# Altium schematic sheet RS485.SchDoc
size A4
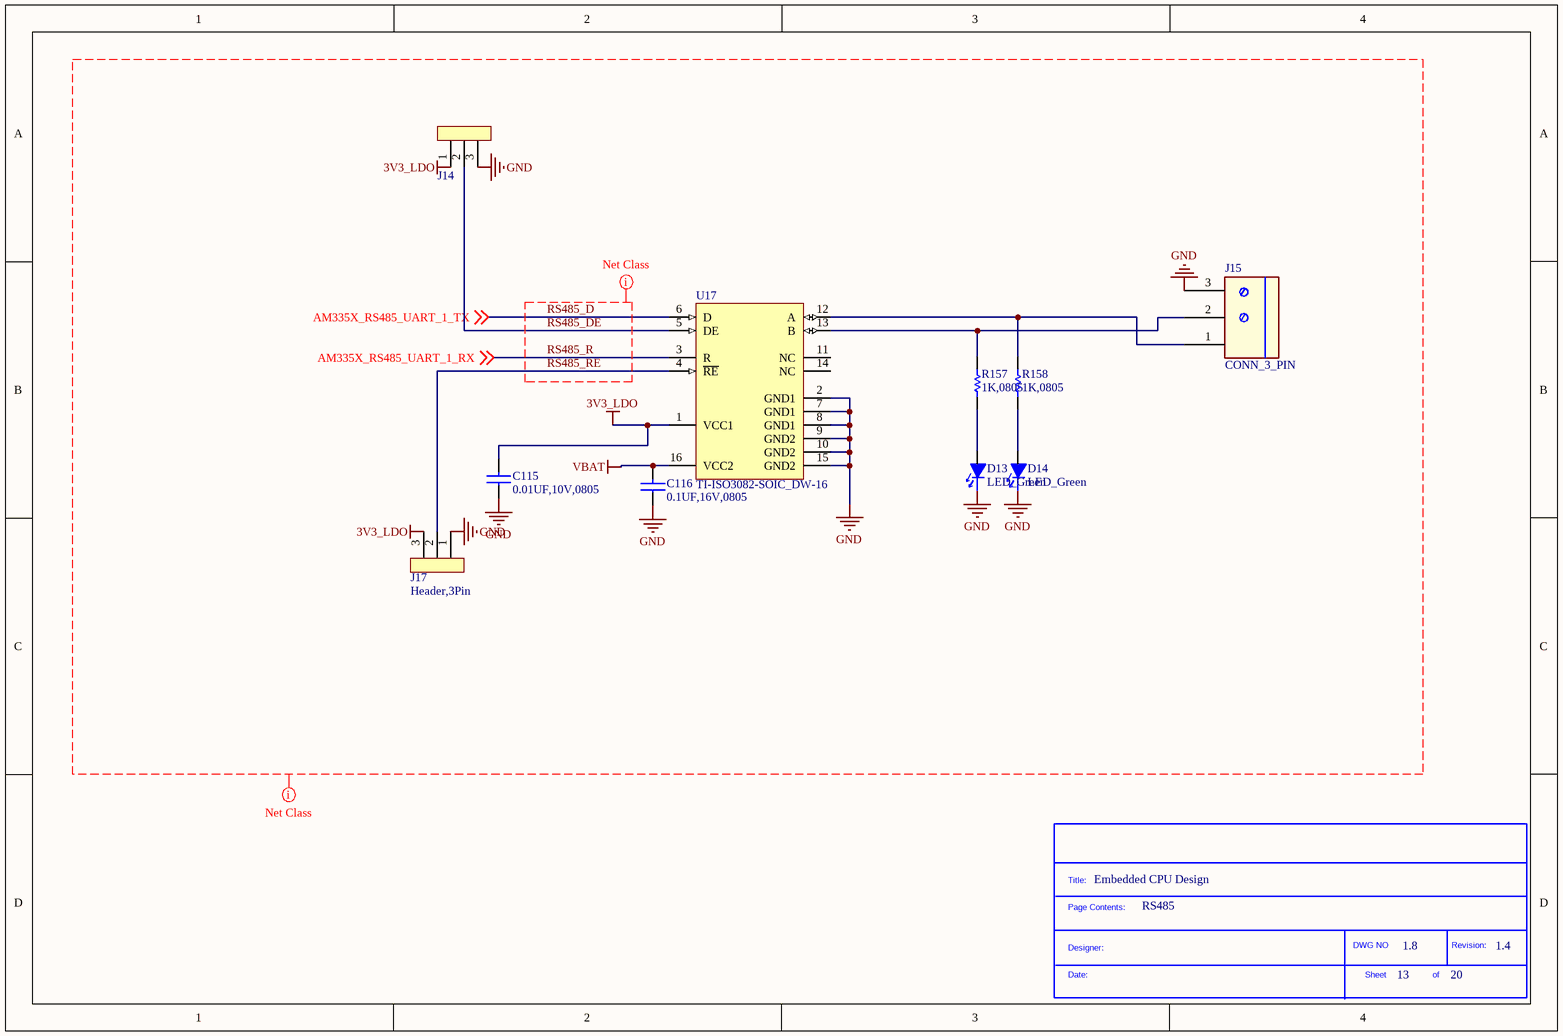
[diagram p0: RS485.SchDoc]

## Parts
*?  SDTitleBlock  (value not drawn)  (graphical)
C115  0.01UF,10V,0805  [0805]
C116  0.1UF,16V,0805  [0805]
D13  LED_Green  [LED_0805]
D14  LED_Green  [LED_0805]
J14  Header,3Pin  [SMD_JUMPER]  (value not drawn)
J15  CONN_3_PIN  [CON_3]
J17  Header,3Pin  [SMD_JUMPER]
R157  1K,0805  [0805]
R158  1K,0805  [0805]
U17  TI-ISO3082-SOIC_DW-16  [DW16_L]

## Nets
3V3_LDO: C115.2 J14.1 J17.3 U17.1(VCC1)
GND: C115.1 C116.1 D13.1(Cathode) D14.1(Cathode) J14.3 J15.3 J17.1 U17.2(GND1) U17.7(GND1) U17.8(GND1) U17.9(GND2) U17.10(GND2) U17.15(GND2)
VBAT: C116.2 U17.16(VCC2)
RS485_D: U17.6(D) ; off-sheet AM335X_RS485_UART_1_TX  [also labelled AM335X_RS485_UART_1_TX]
RS485_DE: J14.2 U17.5(DE)
RS485_R: U17.3(R) ; off-sheet AM335X_RS485_UART_1_RX  [also labelled AM335X_RS485_UART_1_RX]
RS485_RE: J17.2 U17.4(~{RE})
NetD13_2: D13.2(Anode) R157.2
NetD14_2: D14.2(Anode) R158.2
NetJ15_1: J15.1 R158.1 U17.12(A)
NetJ15_2: J15.2 R157.1 U17.13(B)

Not connected (* = marked no-connect by the designer): U17 11(NC) 14(NC)

## Layout directives
net class RS485: RS485_D, RS485_DE, RS485_R, RS485_RE
net class RS485_P: 3V3_LDO, AM335X_RS485_UART_1_RX, AM335X_RS485_UART_1_TX, GND, RS485_D, RS485_DE, RS485_R, RS485_RE, VBAT

## Notes on the sheet
- Embedded CPU Design
- RS485
- 13
- 1.8
- 20
- 1.4
- (in symbol SDTitleBlock) Title:; Page Contents:; DWG NO; Revision:; Designer:; Date:; Sheet; of

## Library data of the parts
C115 = 0.01UF,10V,0805: MULTICOMP - MCSH21B103K100CT - CAP, MLCC, X7R, 10NF, 10V, 0805; Capacitance: 10000pF; Tolerance: ±10%; Voltage - Rated: 16V; Supplier 1: Digi-Key; Manufacturer: MULTICOMP; Manufacturer Part Number: MCSH21B103K100CT; RoHS: YES; Stock 1: 21284; Pricing 1: 1=0.24, 10=0.2, 50=0.1126, 100=0.1, 250=0.075, 500=0.06626, 1000=0.05875 (USD); ComponentLink1URL: http://www.farnell.com/datasheets/1825494.pdf; ComponentLink1Description: http://www.farnell.com/datasheets/1825494.pdf; Supplier Part Number 1: 399-7995-1-ND; Category: Capacitors; Packaging: Cut Tape (CT); Temperature Coefficient: X7R; Mounting Type: Surface Mount, MLCC; Operating Temperature: -55°C ~ 125°C; Applications: General Purpose; Ratings: -; Package / Case: 0805 (2012 Metric); Size / Dimension: 0.079" L x 0.049" W (2.00mm x 1.25mm); Height - Seated (Max): -; Thickness (Max): 0.035" (0.88mm); Lead Spacing: -; Features: -; Lead Style: -; ComponentLink2URL: http://www.kemet.com/docfinder?Partnumber=C0805C103K4RACTU; ComponentLink2Description: http://www.kemet.com/docfinder?Partnumber=C0805C103K4RACTU
C116 = 0.1UF,16V,0805: AVX - 0805YC104KAT2A - CAP, MLCC, X7R, 100NF, 16V, 0805; Capacitance: 0.1; Capacitance Tolerance: ± 10%; Dielectric Characteristic: X7; Voltage Rating: 16; Ceramic Capacitor Case: 0805 [2012 Metric]; SVHC: No SVHC (16-Jun-2014); Capacitor Case Style: 0805 [2012 Metric]<!--FANDB--><div class="features-and-benefits-container"></div>; Tolerance: ±10%; Supplier 1: Digi-Key; Manufacturer: AVX; Manufacturer Part Number: 0805YC104KAT2A; RoHS: YES; Stock 1: 9101; Pricing 1: 1=0.29, 10=0.198, 100=0.1008, 250=0.0816, 500=0.072, 1000=0.0612 (USD); Product Range: -; Operating Temperature Min: -55; Operating Temperature Max: 125; Packaging: Cut Tape; MSL: MSL 1 - Unlimited; Capacitance Tolerance ±: ± 10%; ComponentLink1URL: http://www.farnell.com/datasheets/1679506.pdf; ComponentLink1Description: http://www.farnell.com/datasheets/1679506.pdf; Supplier Part Number 1: 478-7961-1-ND; Category: Capacitors; Voltage - Rated: 16V; Temperature Coefficient: X7R; Mounting Type: Surface Mount, MLCC; Operating Temperature: -55°C ~ 125°C; Applications: General Purpose; Ratings: -; Package / Case: 0805 (2012 Metric); Size / Dimension: 0.079" L x 0.049" W (2.00mm x 1.25mm); Height - Seated (Max): -; Thickness (Max): 0.037" (0.94mm); Lead Spacing: -; Features: -; Lead Style: -; ComponentLink2URL: http://www.avx.com/docs/Catalogs/cx7r.pdf; ComponentLink2Description: http://www.avx.com/docs/Catalogs/cx7r.pdf
D13 D14 = LED_Green: LED Green SMD 20mA 2V 0805; TIIntPartnumber: 1F0008; MfrNum: 598-8170-107F; Mfr: Dialight; PartName: LEDGreen2x1.5; Cost10K: 0.052; Cost100: 0.081; Vendor: Digikey; Wavelength - Dominant: 566nm; Millicandela Rating: 20mcd; Viewing Angle: 140°; Lens Type: Clear; Lens Style/Size: Rectangle with Flat Top, 1.4mm x 1.25mm; DescriptiveText: LED Green SMD 20mA 2V 0805; Descriptive_Text: LED Green SMD 20mA 2V 0805; Supplier 1: Digi-Key; Manufacturer: Dialight; Manufacturer Part Number: 598-8170-107F; RoHS: RoHS Compliant; Category: Optoelectronics; Stock 1: 91030; Pricing 1: 1=0.42, 10=0.31, 25=0.248, 100=0.1643, 250=0.1364, 500=0.0992, 1000=0.0775 (USD); Packaging: Cut Tape (CT); Color: Green; Wavelength - Peak: -; Voltage - Forward (Vf) (Typ): 2V; Current - Test: 20mA; Package / Case: 0805 (2012 Metric); Size / Dimension: 2.00mm L x 1.25mm W; Height: 0.70mm; Mounting Type: Surface Mount; Luminous Flux @ Current - Test: -; ComponentLink1URL: http://media.digikey.com/pdf/Data%20Sheets/Dialight%20PDFs/598_Series_0805_Pkg.pdf; ComponentLink1Description: http://media.digikey.com/pdf/Data%20Sheets/Dialight%20PDFs/598_Series_0805_Pkg.pdf; Supplier Part Number 1: 350-2044-1-ND
R157 R158 = 1K,0805: BOURNS - CR0805-FX-1001ELF - RESISTOR, 1K, 0.125W, 1%; Product Range: BOURNS - CR Series; Resistance: 1; Power Rating: 125; Resistor Case Style: 0805 [2012 Metric]; Resistor Element Material: Thick Film; Temperature Coefficient: ± 100; Voltage Rating: 150; SVHC: No SVHC (16-Jun-2014); Resistor Mounting: SMD<!--FANDB--><div class="features-and-benefits-container"></div>; Power (Watts): 0.125W, 1/8W; Manufacturer: BOURNS; Manufacturer Part Number: CR0805-FX-1001ELF; RoHS: YES; Resistance Tolerance: ± 1%; Packaging: Cut Tape; MSL: MSL 1 - Unlimited; ComponentLink1URL: http://www.farnell.com/datasheets/1845293.pdf; ComponentLink1Description: http://www.farnell.com/datasheets/1845293.pdf; Supplier 1: Digi-Key; Category: Resistors; Stock 1: 2060902; Pricing 1: 1=0.1, 50=0.0288, 100=0.0219, 250=0.01624, 500=0.012, 1000=0.008, 2500=0.00675 (USD); Resistance (Ohms): 1k; Tolerance: ±1%; Composition: Thick Film; Features: Automotive AEC-Q200; Operating Temperature: -55°C ~ 155°C; Package / Case: 0805 (2012 Metric); Supplier Device Package: 0805; Size / Dimension: 0.079" L x 0.049" W (2.00mm x 1.25mm); Height: 0.028" (0.70mm); Number of Terminations: 2; ComponentLink2URL: http://industrial.panasonic.com/www-cgi/jvcr13pz.cgi?E+PZ+3+AOA0002+ERJ6ENF1001V+7+WW; ComponentLink2Description: http://industrial.panasonic.com/www-cgi/jvcr13pz.cgi?E+PZ+3+AOA0002+ERJ6ENF1001V+7+WW; Supplier Part Number 1: P1.00KCCT-ND
U17 = TI-ISO3082-SOIC_DW-16: Manufacturer: Texas Instruments; Manufacturer Part Number: ISO3082DWR; Isolated Power: Yes; Number of Channels: 3; Inputs - Side 1/Side 2: 2/1; Channel Type: Unidirectional; Voltage - Isolation: 4000Vpk; Common Mode Transient Immunity (Min): 25kV/µs; Data Rate: 200Kbps; Pulse Width Distortion (Max): 200ns, 200ns; Voltage - Supply: 3.15 V ~ 5.5 V, 4.5 V ~ 5.5 V; Supplier 1: Digi-Key; Supplier Part Number 1: 296-37891-1-ND; RoHS: RoHS Compliant; Category: Isolators; Stock 1: 487; Pricing 1: 1=6.74, 10=6.037, 25=5.4288, 100=4.9374, 250=4.4694, 500=4.0014, 750=3.627, 1000=3.3696 (USD); Packaging: Cut Tape (CT); Technology: Capacitive Coupling; Type: RS422, RS485; Propagation Delay tpLH / tpHL (Max): -; Rise / Fall Time (Typ): -; Operating Temperature: -40°C ~ 85°C; Package / Case: 16-SOIC (0.295", 7.50mm Width); Supplier Device Package: 16-SOIC; ComponentLink1URL: http://www.ti.com/lit/ds/symlink/iso3082.pdf; ComponentLink1Description: http://www.ti.com/lit/ds/symlink/iso3082.pdf